# Altium schematic sheet USB_CP2104.SchDoc: CP2104 USB to Serial
size A4; Author: Andrés Gullón; DocumentNumber: 5; SheetNumber: 5; SheetTotal: 9
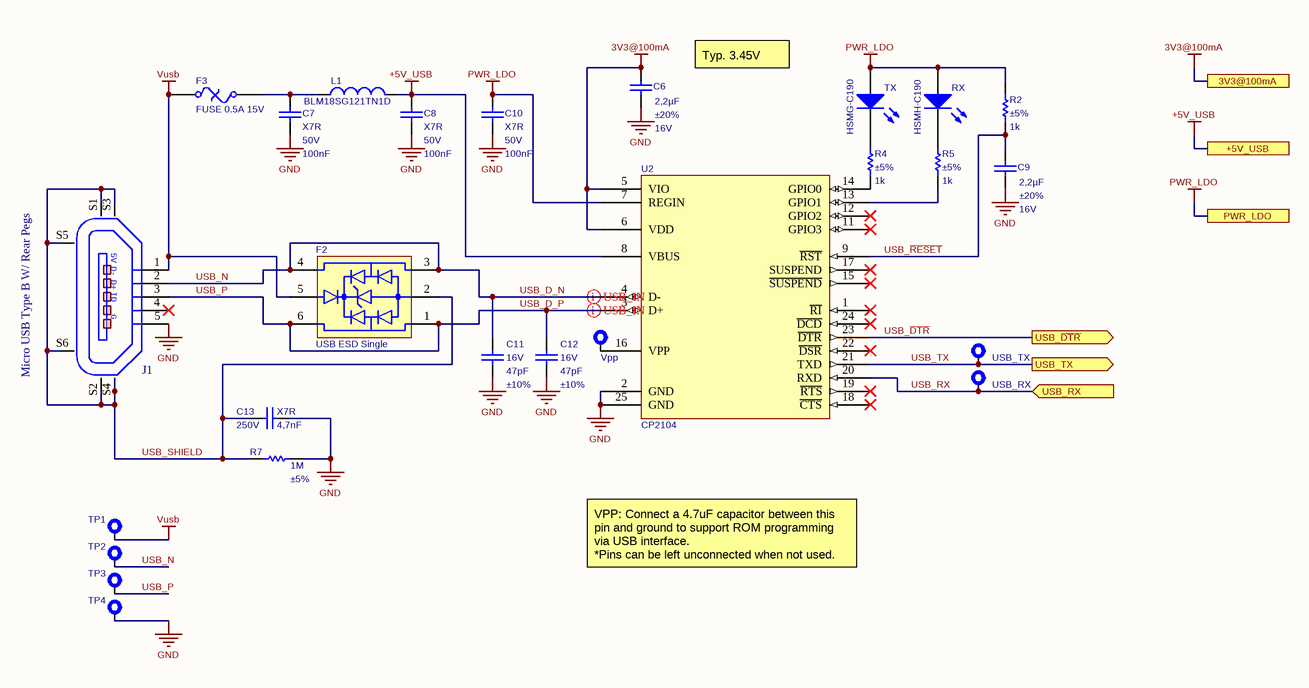
[diagram p0: USB_CP2104.SchDoc]

## Parts
C6  Voltage: 16V  Capacitance: 2,2µF  Tolerance: ±20%  [C0402]  (hidden comment: C0402_2.2uF_16V_±20%)
C7  Dielectric: X7R  Voltage: 50V  Capacitance: 100nF  [C0603]  (hidden comment: C0603_100nF_50V_±10%_X7R)
C8  Dielectric: X7R  Voltage: 50V  Capacitance: 100nF  [C0603]  (hidden comment: C0603_100nF_50V_±10%_X7R)
C9  Voltage: 16V  Capacitance: 2,2µF  Tolerance: ±20%  [C0402]  (hidden comment: C0402_2.2uF_16V_±20%)
C10  Dielectric: X7R  Voltage: 50V  Capacitance: 100nF  [C0603]  (hidden comment: C0603_100nF_50V_±10%_X7R)
C11  Voltage: 16V  Capacitance: 47pF  Tolerance: ±10%  [C0402]  (hidden comment: C0402_47pF_16V_±10%)
C12  Voltage: 16V  Capacitance: 47pF  Tolerance: ±10%  [C0402]  (hidden comment: C0402_47pF_16V_±10%)
C13  Dielectric: X7R  Voltage: 250V  Capacitance: 4,7nF  [C0805]  (hidden comment: C0805_4700pF_250V_±10%_X7R)
F2  USB ESD Single  [SOT563]
F3  FUSE 0.5A 15V  [F1812]
J1  Micro USB Type B W/ Rear Pegs  [USB_B_W_REAR_PEGS]
L1  OrderingCode: BLM18SG121TN1D  [L0603]  (hidden comment: L0603_120R_0,025R_3000mA)
R2  Tolerance: ±5%  Resistance: 1k  [R0402]  (hidden comment: R0402_1k_0.063W_±5%)
R4  Tolerance: ±5%  Resistance: 1k  [R0402]  (hidden comment: R0402_1k_0.063W_±5%)
R5  Tolerance: ±5%  Resistance: 1k  [R0402]  (hidden comment: R0402_1k_0.063W_±5%)
R7  Tolerance: ±5%  Resistance: 1M  [R0603]  (hidden comment: R0603_1M_0.1W_±5%)
RX  HSMH-C190  [LED0603]
TP1  TP  [TP_POWER]  (value not drawn)  (no BOM)
TP2  TP_POWER  [TP_POWER]  (value not drawn)  (no BOM)
TP3  TP_POWER  [TP_POWER]  (value not drawn)  (no BOM)
TP4  TP_POWER  [TP_POWER]  (value not drawn)  (no BOM)
TX  HSMG-C190  [LED0603]
U2  CP2104  [QFN24_no_power]
USB_RX  TP_POWER  [TP_POWER]  (value not drawn)  (no BOM)
USB_TX  TP_POWER  [TP_POWER]  (value not drawn)  (no BOM)
Vpp  TP_POWER  [TP_POWER]  (value not drawn)  (no BOM)

## Ports
3V3@100mA, +5V_USB, PWR_LDO, USB_RX (in), USB_TX (out), USB_~{DTR} (out)

## Nets
3V3@100mA: C6.2 U2.5(VIO) U2.6(VDD) ; port 3V3@100mA
+5V_USB: C8.2 L1.2 U2.8(VBUS) ; port +5V_USB
GND: C6.1 C7.1 C8.1 C9.1 C10.1 C11.1 C12.1 C13.2 J1.5(P5) R7.1 TP4.1 U2.2(GND) U2.25(GND)
PWR_LDO: C10.2 R2.2 RX.A TX.A U2.7(REGIN) ; port PWR_LDO
Vusb: F2.5 F3.1 J1.1(P1) TP1.1
USB_~{DTR}: U2.23(~{DTR}) ; port USB_~{DTR}
USB_D_N: C11.2 F2.3 F2.4 J1.2(P2) TP2.1 U2.4(D-)  [also labelled USB_N]
USB_D_P: C12.2 F2.1 F2.6 J1.3(P3) TP3.1 U2.3(D+)  [also labelled USB_P]
USB_~{RESET}: C9.2 R2.1 U2.9(~{RST})
USB_RX: U2.20(RXD) USB_RX.1 ; port USB_RX
USB_SHIELD: C13.1 F2.2 J1.S1(SHLD1) J1.S2(SHLD2) J1.S3(SHLD3) J1.S4(SHLD4) J1.S5(SHLD5) J1.S6(SHLD6) R7.2
USB_TX: U2.21(TXD) USB_TX.1 ; port USB_TX
NetC7_2: C7.2 F3.2 L1.1
NetR4_1: R4.1 U2.14(GPIO0)
NetR4_2: R4.2 TX.K
NetR5_1: R5.1 U2.13(GPIO1)
NetR5_2: R5.2 RX.K
NetU2_16: U2.16(VPP) Vpp.1

Not connected (* = marked no-connect by the designer): J1 4(P4)*; U2 1(~{RI})* 11(GPIO3)* 12(GPIO2)* 15(~{SUSPEND})* 17(SUSPEND)* 18(~{CTS})* 19(~{RTS})* 22(~{DSR})* 24(~{DCD})*

## Layout directives
differential pair: USB_D_N, USB_D_P

## Notes on the sheet
- Typ. 3.45V
- VPP: Connect a 4.7uF capacitor between this pin and ground to support ROM programming via USB interface.
  *Pins can be left unconnected when not used.
- Title
- Project
- Size:
- Author
- A4
- Number:
- Revision:
- Mundo Reader, S.L. This project and all the sheets and layouts enclosed are licensed under Creative Commons by Attribution and Share Alike [CC BY-SA] (www.creativecommons.com)
- Date:
- Time:
- Sheet
- of
- (in symbol CMP-A2224-4) 5V; D-; D+; ID; G

## Library data of the parts
C6 C9 = CMP-A0550-4: C0402_2.2uF_16V_±20%_X5R; Part Number: C0402_2.2uF_16V_±10%; Manufacturer: TDK; Value: 2,2µF ±20% 16V; Dielectric: X5R; OrderingCode: C1005X5R1C225M050BC; Temp_ Max: 125; Temp_ Min: -55; AccessRights: 2147483647; ContentType: Component; Description ES: Condensador; Folder: Components Library\Pasives\Capacitor_SMD\C0402_16V$\; OrderingCode 2: EMK105ABJ225MV-F; RevisionId: 3; SchLibComponentName: Capacitor; Price units: EUR; ComponentType: Capacitor; ContentTypeGUID: CB3C11C4-E317-11DF-B822-12313F0024A2; FolderGUID: B1BE7916-43F7-4918-A273-F24409A7170B; ItemGUID: BD471B44-C1FF-4F80-85CC-AC0CC62DE9EE; ItemHRID: CMP-A0550; LifeCycle: New From Design; LifeCycleStateGUID: 706004B5-C76E-482E-903B-BA0E4FAE086A; Manufacturer 2: Taiyo Yuden; ReleaseDate: 04/09/2017 08:02:11 AM
C7 C8 C10 = CMP-00257-1: Manufacturer: Kemet; Description ES: Condensador; OrderingCode: C0603C104K5RAC; OrderingCode 2: 06035C104KAT2A; SchLibComponentName: Capacitor; Temp_ Max: 125; Temp_ Min: -55; Tolerance: ±10%; Value: 100nF ±10% 50V; Manufacturer 2: AVX; Part Number: C0603_100nF_50V_±10%_X7R; Price units: EUR
C11 C12 = CMP-A0572-2: Manufacturer: Kemet; Value: 47pF ±10% 16V; Dielectric: C0G; OrderingCode: C0402C470K4GAC; Temp_ Max: 125; Temp_ Min: -55; AccessRights: 2147483647; ContentType: Component; Description ES: Condensador; Folder: Components Library\Pasives\Capacitor_SMD\C0402_16V$\; RevisionId: 1; SchLibComponentName: Capacitor; Part Number: C0402_47pF_16V_±10%; Price units: EUR; ComponentType: Capacitor; ContentTypeGUID: CB3C11C4-E317-11DF-B822-12313F0024A2; FolderGUID: B1BE7916-43F7-4918-A273-F24409A7170B; ItemGUID: BA17F97B-A8F2-4344-A89B-4AB43394B9E9; ItemHRID: CMP-A0572; LifeCycle: New From Design; LifeCycleStateGUID: 706004B5-C76E-482E-903B-BA0E4FAE086A; ReleaseDate: 19/02/2016 10:21:00 AM
C13 = CMP-00357-1: Manufacturer: Kemet; Description ES: Condensador; OrderingCode: C0805S472KARACTU; OrderingCode 2: GRM21AR72E472KW01D; SchLibComponentName: Capacitor; Temp_ Max: 125; Temp_ Min: -55; Tolerance: ±10%; Value: 4,7nF ±10% 250V; Manufacturer 2: Murata; Price units: EUR
F2 = CMP-A2443-2: TVS Diode Array; Manufacturer: Würth Elektronik; OrderingCode: 82400152; Description ES: Array de diodos TVS; Temp_ Max: 125; Temp_ Min: -40; OrderingCode 2: CDSOT563-0502; SchLibComponentName: ESDUSB; Part Number: USB ESD Single; Supplier: Würth Elektronik; Price units: EUR; Manufacturer 2: Bourns
F3 = CMP-A2421-1: Resettable Fuses; Manufacturer: Bourns; OrderingCode: MF-MSMF050-2; Description ES: Fusible reseteable; Temp_ Max: 85; Temp_ Min: -40; SchLibComponentName: PTC_Fuse; Part Number: FUSE 0.5A 15V; Voltage: 15V; Current: 0.5A; Price units: EUR
J1 = CMP-A2224-4: Manufacturer: FCI; OrderingCode: 10118194-0001LF; Description ES: Conector; Temp_ Max: 105; Temp_ Min: -40; SchLibComponentName: USB_Micro_Type_B; Part Number: Micro USB Type B W/ Rear Pegs; Price units: EUR
L1 = CMP-A0708-2: Manufacturer: Murata; Resistance_100MHz: 120R; Resistance_DC: 0,025R; Current: 3000mA; Temp_ Max: 125; Temp_ Min: -55; Value: 120R 0,025R 3000mA; Description ES: Ferrita; SchLibComponentName: Ferrite Bead; Part Number: L0603_120R_0,025R_3000mA; Price units: EUR
R2 R4 R5 = CMP-A1718-3: Manufacturer: Vishay; OrderingCode: CRCW04021K00JN; Power: 0.063W; Value: 1k ±5% 0.063W; Temp_ Max: 155; Temp_ Min: -55; Description ES: Resistencia; SchLibComponentName: Resistor; PackageDescription: SMD; Part Number: R0402_1k_0.063W_±5%; Price units: EUR
R7 = CMP-A1358-3: Manufacturer: Vishay; OrderingCode: CRCW06031M00JN; Power: 0.1W; Value: 1M ±5% 0.1W; Temp_ Max: 155; Temp_ Min: -55; Description ES: Resistencia; SchLibComponentName: Resistor; PackageDescription: SMD; Part Number: R0603_1M_0.1W_±5%; Price units: EUR
RX = CMP-A2546-1: LED; Manufacturer: Avago Technologies; Temp_ Max: 85; Temp_ Min: -40; OrderingCode 2: LS Q976-NR-1; Value: Red; SchLibComponentName: LED; Part Number: HSMH-C190; OrderingCode: HSMH-C190; Description ES: LED; Price units: EUR; Manufacturer 2: OSRAM Opto
TP1-TP4 USB_RX USB_TX Vpp = CMP-A2499-3: Testpoint 0.3mm; Manufacturer: Oxley; OrderingCode: SMOX/060/B1; SAP: 303552; SchLibComponentName: Testpoint; Part Number: TP_POWER; Price units: EUR
TX = CMP-A2544-1: LED; Manufacturer: Avago Technologies; Temp_ Max: 85; Temp_ Min: -40; OrderingCode 2: LG Q971-KN-1; Value: Green; SchLibComponentName: LED; Part Number: HSMG-C190; OrderingCode: HSMG-C190; Description ES: LED; Price units: EUR; Manufacturer 2: OSRAM Opto
U2 = CMP-A2587-1: USB to UART Bridge; Manufacturer: Silicon Labs; OrderingCode: CP2104-F03-GMR; Description ES: Interfaz USB a UART; Temp_ Max: 85; Temp_ Min: -40; SchLibComponentName: CP2104; Part Number: CP2104; Supplier: Silica; Supplier cod: AC1190; Price units: EUR